# EAGLE schematic android (EAGLE 5.12)
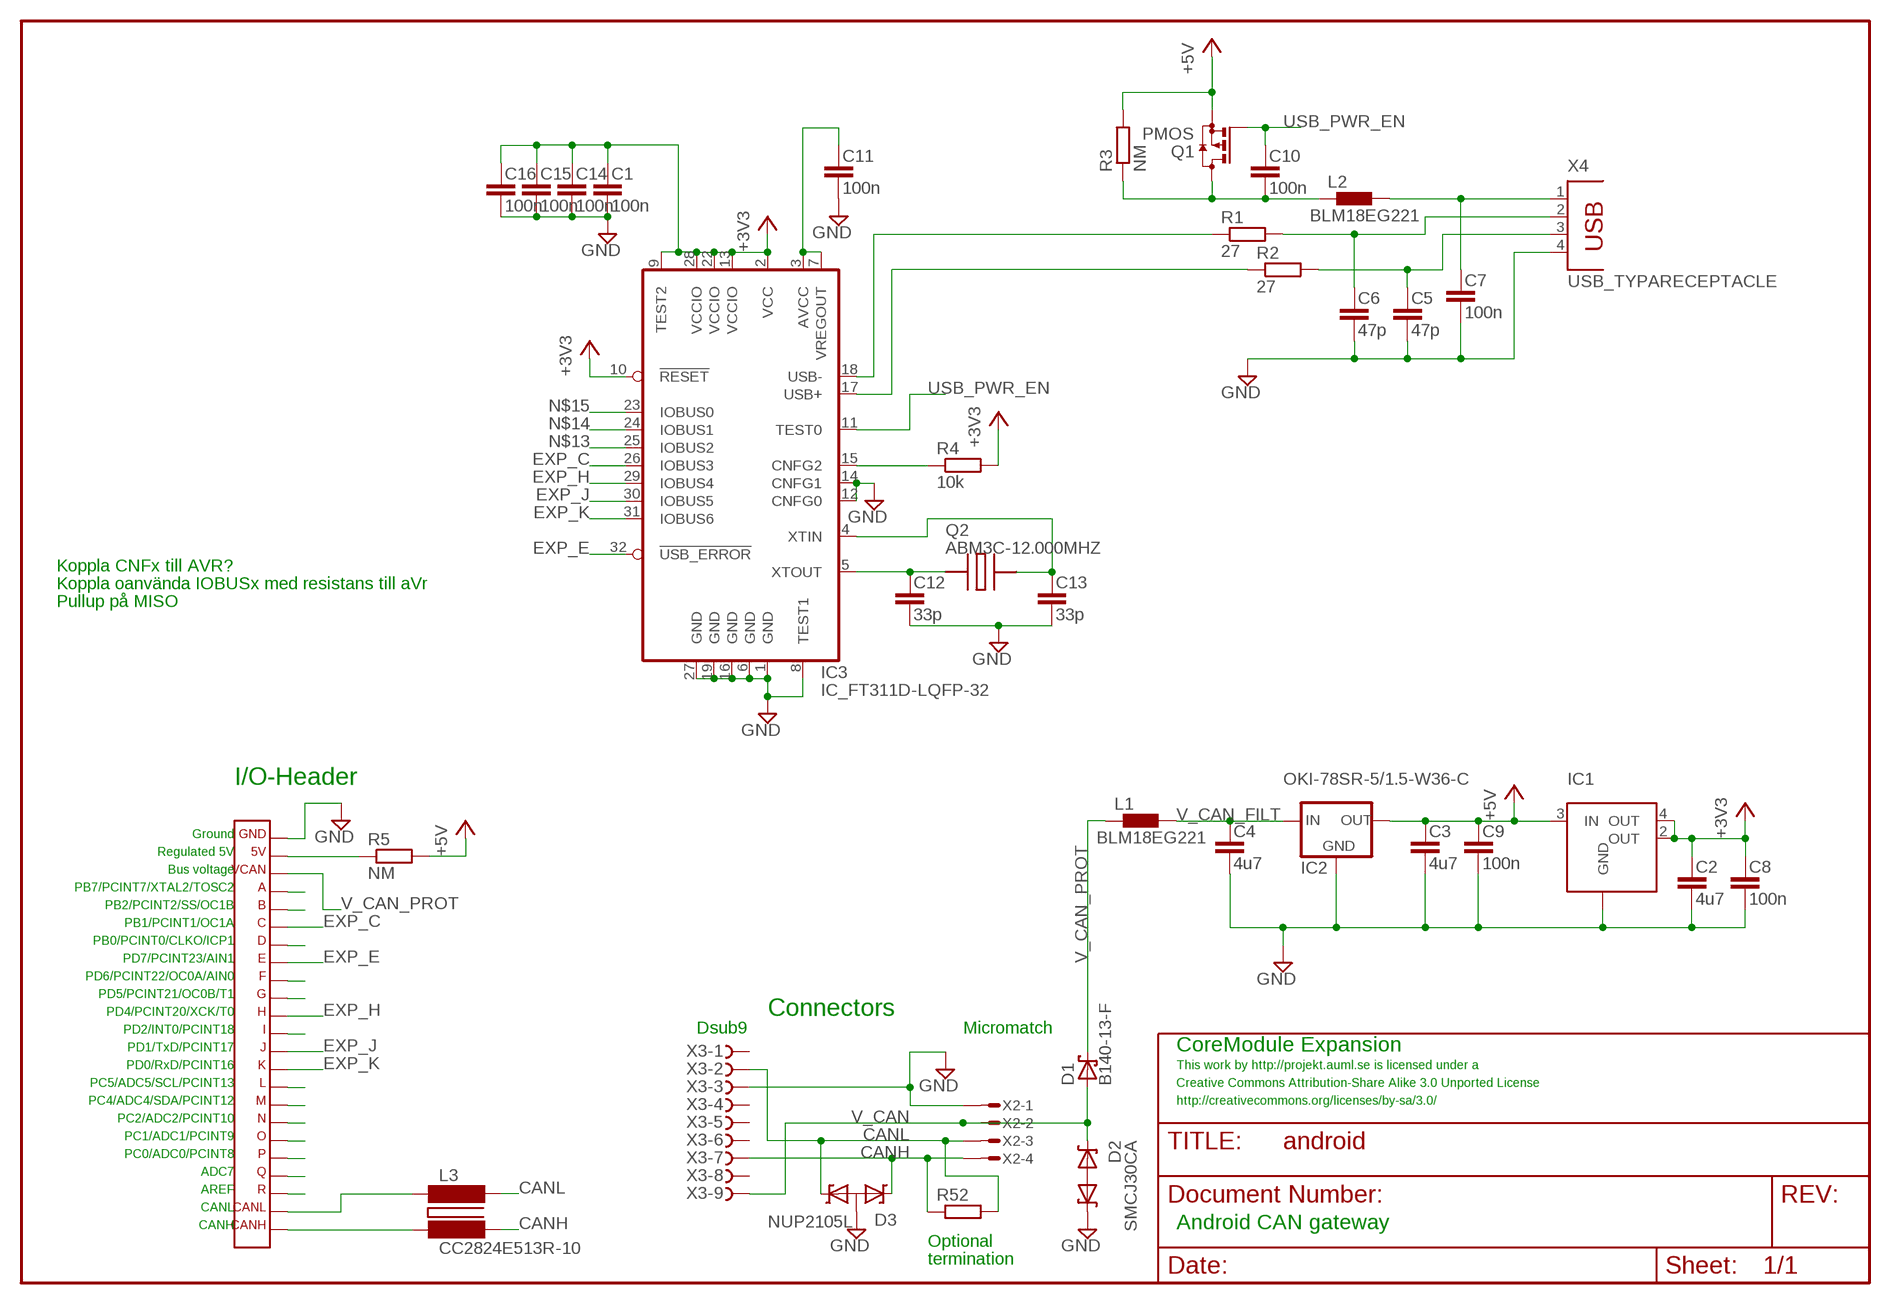
[diagram p0: schematic, sheet 1]

## Parts
C1  100n  C-EUC0603  [C0603]
C2  4u7  C-EUC0805  [C0805]
C3  4u7  C-EUC0805  [C0805]
C4  4u7  C-EUC0805  [C0805]
C5  47p  C-EUC0603  [C0603]
C6  47p  C-EUC0603  [C0603]
C7  100n  C-EUC0603  [C0603]
C8  100n  C-EUC0603  [C0603]
C9  100n  C-EUC0603  [C0603]
C10  100n  C-EUC0603  [C0603]
C11  100n  C-EUC0603  [C0603]
C12  33p  C-EUC0603  [C0603]
C13  33p  C-EUC0603  [C0603]
C14  100n  C-EUC0603  [C0603]
C15  100n  C-EUC0603  [C0603]
C16  100n  C-EUC0603  [C0603]
D1  B140-13-F  SCHOTTKY-DIODESMA  [SMA]
D2  SMCJ30CA  TVS2SMC  [SMC]
D3  NUP2105L  TVSSOT23  [SOT23]
IC1  LM1117IMPX-3.3  LM1117MP-3.3  [SOT223]
IC2  OKI-78SR-5/1.5-W36-C  78XXS"  [78XXS]
IC3  IC_FT311D-LQFP-32  [LQFP-32]
L1  BLM18EG221  L-EUL0603  [L0603]
L2  BLM18EG221  L-EUL0603  [L0603]
L3  CC2824E513R-10  CC2824E513R-10CC2824E513R-10  [CC2824E513R-10]
Q1  PMOS  [SOT23]
Q2  ABM3C-12.000MHZ  ABMMABM3C  [SMD2]
R1  27  R-EUR0603  [R0603]
R2  27  R-EUR0603  [R0603]
R3  NM  R-EUR0603  [R0603]
R4  10k  R-EUR0603  [R0603]
R5  NM  R-EUR0603  [R0603]
R52  R-EUR2010  [R2010]
X1  CORETWO_LAYOUTISPHOLES_CU  [CORETWO_LAYOUT_ISPHOLES_CU]
X2  MICROMATCH-4  [MICROMATCH-4]
X3  F09S  F09HS  [F09H]
X4  USB_TYPARECEPTACLE  [FCI_RECEPTACLE]

## Nets
+3V3: C1.1 C2.1 C8.1 C14.1 C15.1 C16.1 IC1.2(OUT) IC1.4(OUT) IC3.2(VCC) IC3.9(TEST2) IC3.10(!RESET) IC3.13(VCCIO) IC3.22(VCCIO) IC3.28(VCCIO) R4.2
+5V: C3.1 C9.1 IC1.3(IN) IC2.OUT Q1.2(S) R3.2 R5.2
CANH: D3.1(C1) L3.3 R52.1 X2.4 X3.7
CANH_FILT: L3.2 X1.CANH
CANL: D3.2(C2) L3.4 R52.2 X2.3 X3.2
CANL_FILT: L3.1 X1.CANL
EXP_A: X1.A
EXP_B: X1.B
EXP_C: IC3.26(IOBUS3) X1.C
EXP_D: X1.D
EXP_E: IC3.32(!USB_ERROR) X1.E
EXP_F: X1.F
EXP_G: X1.G
EXP_H: IC3.29(IOBUS4) X1.H
EXP_I: X1.I
EXP_J: IC3.30(IOBUS5) X1.J
EXP_K: IC3.31(IOBUS6) X1.K
EXP_L: X1.L
EXP_M: X1.M
EXP_N: X1.N
EXP_O: X1.O
EXP_P: X1.P
EXP_Q: X1.Q
EXP_R: X1.R
GND: C1.2 C2.2 C3.2 C4.2 C5.2 C6.2 C7.2 C8.2 C9.2 C11.2 C12.2 C13.2 C14.2 C15.2 C16.2 D2.A(C1) D3.3(A) IC1.1(GND) IC2.GND IC3.1(GND) IC3.6(GND) IC3.8(TEST1) IC3.12(CNFG0) IC3.14(CNFG1) IC3.16(GND) IC3.19(GND) IC3.27(GND) X1.GND X2.1 X3.3 X4.4
N$1: C7.1 L2.2 X4.1
N$2: C10.2 L2.1 Q1.3(D) R3.1
N$5: IC3.17(USB+) R2.1
N$6: IC3.18(USB-) R1.1
N$7: C6.1 R1.2 X4.2
N$8: C5.1 R2.2 X4.3
N$10: IC3.15(CNFG2) R4.1
N$12: C11.1 IC3.3(AVCC) IC3.7(VREGOUT)
N$13: IC3.25(IOBUS2)
N$14: IC3.24(IOBUS1)
N$15: IC3.23(IOBUS0)
N$16: C13.1 IC3.4(XTIN) Q2.2
N$17: C12.1 IC3.5(XTOUT) Q2.1
USB_PWR_EN: C10.1 IC3.11(TEST0) Q1.1(G)
V_CAN: D1.A D2.C(C2) X2.2 X3.9
V_CAN_FILT: C4.1 IC2.IN L1.2
V_CAN_PROT: D1.C L1.1 X1.VCAN
VCC: R5.1 X1.5V
Unconnected: X3.1 X3.4 X3.5 X3.6 X3.8

## Notes on the sheet
- Koppla CNFx till AVR?
- Koppla oanvända IOBUSx med resistans till aVr
- Pullup på MISO
- I/O-Header
- Ground
- Regulated 5V
- Bus voltage
- PB7/PCINT7/XTAL2/TOSC2
- PB2/PCINT2/SS/OC1B
- PB1/PCINT1/OC1A
- PB0/PCINT0/CLKO/ICP1
- PD7/PCINT23/AIN1
- PD6/PCINT22/OC0A/AIN0
- PD5/PCINT21/OC0B/T1
- PD4/PCINT20/XCK/T0 | Connectors
- PD2/INT0/PCINT18 | Dsub9 | Micromatch
- PD1/TxD/PCINT17 | CoreModule Expansion
- PD0/RxD/PCINT16 | This work by http://projekt.auml.se is licensed under a
- PC5/ADC5/SCL/PCINT13 | Creative Commons Attribution-Share Alike 3.0 Unported License
- PC4/ADC4/SDA/PCINT12 | http://creativecommons.org/licenses/by-sa/3.0/
- PC2/ADC2/PCINT10
- PC1/ADC1/PCINT9
- PC0/ADC0/PCINT8
- ADC7
- AREF
- CANL
- CANH | Android CAN gateway
- Optional
- termination

## Power pins joined to a net without a drawn wire
GND: Q2.GND@0(GND) Q2.GND@1(GND)

## Library data of the parts
C1-C16 = rcl:C-EU
D1 = diode:SCHOTTKY-DIODE
D2 = diode:TVS2
D3 = diode:TVS
IC1 = lm1117mp:LM1117MP-3.3
IC2 = 78xx:78XXS: VOLTAGE REGULATOR
IC3 = dp_devices:IC_FT311D: USB Android Host Mfr no: FT311D-32L1C FT311D <http://www.ftdichip.com/Support/Documents/DataSheets/ICs/DS_FT311D.pdf>
L1 L2 = rcl:L-EU
L3 = choke:CC2824E513R-10
Q1 = transistor:PMOS
Q2 = abmm:ABMM
R1-R5 R52 = rcl:R-EU
X1 = expboard:CORETWO_LAYOUT
X2 = con-amp-micromatch:MICROMATCH-4: MicroMaTch 4 7-215464-4 / 0-215464-4 Drawing Number C-215464 DDEController.pdf
X3 = dsub:F09?S
X4 = usba:USB_TYPA